# Altium schematic sheet audio.SchDoc
size A4
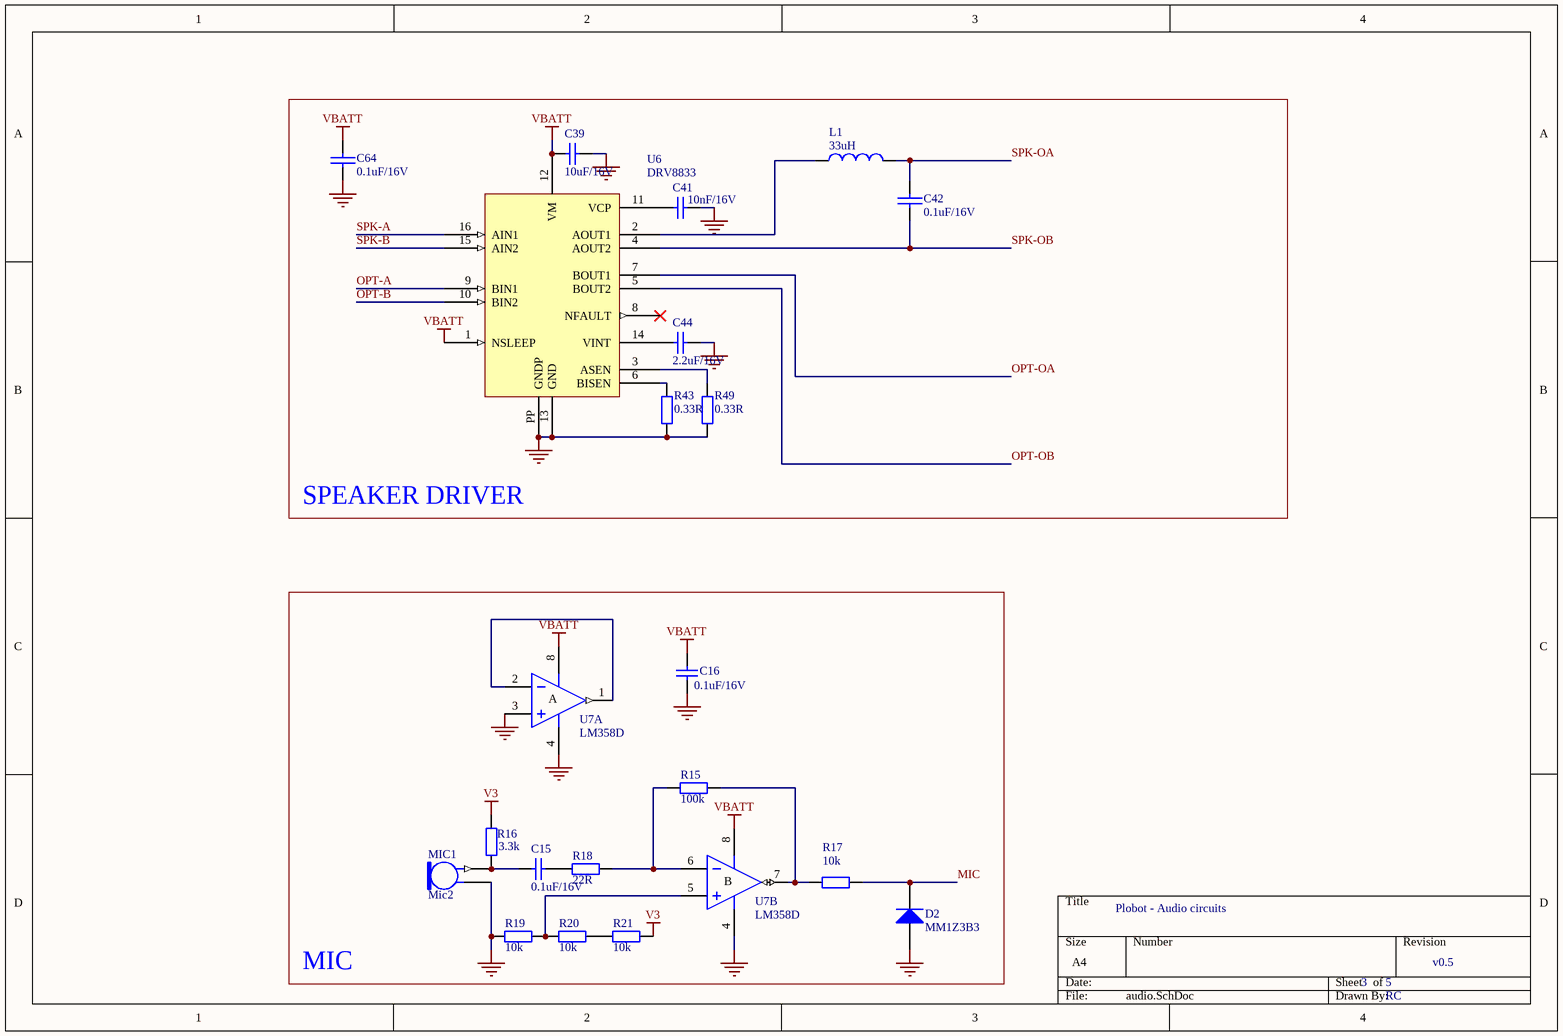
[diagram p0: audio.SchDoc]

## Parts
C15  0.1uF/16V  [CAPC1608N]
C16  0.1uF/16V  [CAPC1608N]
C39  10uF/16V  [CAPC1608N]
C41  10nF/16V  [CAPC1608N]
C42  0.1uF/16V  [CAPC1608N]
C44  2.2uF/16V  [CAPC1608N]
C64  0.1uF/16V  [CAPC1608N]
D2  MM1Z3B3  [SOD123/X.85]
L1  33uH  [INDC1608N]
MIC1  Mic2  [electret_6mm]
R15  100k  [RESC1608N]
R16  3.3k  [RESC1608N]
R17  10k  [RESC1608N]
R18  22R  [RESC1608N]
R19  10k  [RESC1608N]
R20  10k  [RESC1608N]
R21  10k  [RESC1608N]
R43  0.33R  [RESC1608N]
R49  0.33R  [RESC1608N]
U6  DRV8833  [DRV8833]
U7  LM358D  [LM358D]  (parts A,B of 2)

## Blocks framed on the sheet
SPEAKER DRIVER: C39 C41 C42 C44 C64 L1 R43 R49 U6
MIC: C15 C16 D2 MIC1 R15-R21 U7

## Nets
GND: C16.2 C39.1 C41.1 C44.1 C64.1 D2.2(A) MIC1.2 R19.1 R43.1 R49.1 U6.13(GND) U6.PP(GNDP) U7.3(IN+) U7.4(V-)
V3: R16.1 R21.2
VBATT: C16.1 C39.2 C64.2 U6.1(NSLEEP) U6.12(VM) U7.8(V+)
MIC: D2.1(K) R17.2
OPT-A: U6.9(BIN1)
OPT-B: U6.10(BIN2)
OPT-OA: U6.7(BOUT1)
OPT-OB: U6.5(BOUT2)
SPK-A: U6.16(AIN1)
SPK-B: U6.15(AIN2)
SPK-OA: C42.2 L1.2
SPK-OB: C42.1 U6.4(AOUT2)
NetC15_1: C15.1 R18.1
NetC15_2: C15.2 MIC1.1 R16.2
NetC41_2: C41.2 U6.11(VCP)
NetC44_2: C44.2 U6.14(VINT)
NetL1_1: L1.1 U6.2(AOUT1)
NetR15_1: R15.1 R18.2 U7.6(IN-)
NetR15_2: R15.2 R17.1 U7.7(OUT)
NetR19_2: R19.2 R20.1 U7.5(IN+)
NetR20_2: R20.2 R21.1
NetR43_2: R43.2 U6.6(BISEN)
NetR49_2: R49.2 U6.3(ASEN)
NetU7_1: U7.1(OUT) U7.2(IN-)

Not connected (* = marked no-connect by the designer): U6 8(NFAULT)*

## Notes on the sheet
- Plobot - Audio circuits
- 3
- 5
- v0.5
- RC
- (in symbol LM358D, part A) A
- (in symbol LM358D, part B) B

## Library data of the parts
C15 C16 C41 C42 C44 C64 = Cap: Capacitor
  C15 C16: Published: 8-Jun-2000; LatestRevisionDate: 17-Jul-2002; LatestRevisionNote: Re-released for DXP Platform.; PackageReference: RAD-0.3; Publisher: Altium Limited; PackageDescription: Radial Cap, Thru-Hole; 2 Leads; 0.3 in Pin Spacing; Value: 0.1uF/16V
  C41: Published: 8-Jun-2000; LatestRevisionDate: 17-Jul-2002; LatestRevisionNote: Re-released for DXP Platform.; PackageReference: RAD-0.3; Publisher: Altium Limited; PackageDescription: Radial Cap, Thru-Hole; 2 Leads; 0.3 in Pin Spacing; Value: 10nF/16V
  C44: Published: 8-Jun-2000; LatestRevisionDate: 17-Jul-2002; LatestRevisionNote: Re-released for DXP Platform.; PackageReference: RAD-0.3; Publisher: Altium Limited; PackageDescription: Radial Cap, Thru-Hole; 2 Leads; 0.3 in Pin Spacing; Value: 2.2uF/16V
C39 = Cap_2: Capacitor; Published: 8-Jun-2000; LatestRevisionDate: 17-Jul-2002; LatestRevisionNote: Re-released for DXP Platform.; PackageReference: RAD-0.3; Publisher: Altium Limited; PackageDescription: Radial Cap, Thru-Hole; 2 Leads; 0.3 in Pin Spacing; Value: 10uF/16V
D2 = Diode: Default Diode; Published: 8-Jun-2000; LatestRevisionDate: 17-Jul-2002; LatestRevisionNote: Re-released for DXP Platform.; PackageVersion: Sep-1996; PackageReference: SMC; Publisher: Altium Limited; Code_JEDEC: DO-214-AB
L1 = Inductor: Code_IEC: 1005; Published: 8-Jun-2000; LatestRevisionDate: 29-May-2009; LatestRevisionNote: IPC-7351 Footprint Added.; PackageReference: 0402-A; Publisher: Altium Limited; PackageDescription: Chip Inductor; Code_JEITA: 0402; Value: 33uH
MIC1 = Mic2: Microphone; value: KUF4323; Published: *; LatestRevisionDate: *; LatestRevisionNote: *; PackageReference: *; Publisher: *
R15-R21 R43 R49 = Res2: Resistor; Published: 8-Jun-2000; LatestRevisionDate: 17-Jul-2002; LatestRevisionNote: Re-released for DXP Platform.; PackageReference: AXIAL-0.4; Publisher: Altium Limited
  R15: Value: 100k
  R16: Value: 3.3k
  R17 R19-R21: Value: 10k
  R18: Value: 22R
  R43 R49: Value: 0.33R
U7 = LM358D: Dual Operational Amplifier; Published: 16-Jan-2001; LatestRevisionDate: 13-Apr-2006; LatestRevisionNote: IPC-7351 Footprint Added.; DatasheetVersion: Jul-1998; PackageVersion: Jan-1998; PackageReference: D008; Publisher: Altium Limited; PackageDescription: 8-Pin Small Outline Integrated Circuit 1.27 mm Pitch; Code_IPC: SOIC127P600-8; ComponentLink1Description: Manufacturer Link; ComponentLink1URL: http://www.ti.com/; ComponentLink2Description: Datasheet; ComponentLink2URL: http://www-s.ti.com/sc/ds/lm358.pdf